# EAGLE design mp3412-boost-driver-15mm-mk-1.0 (EAGLE 7.5.0)
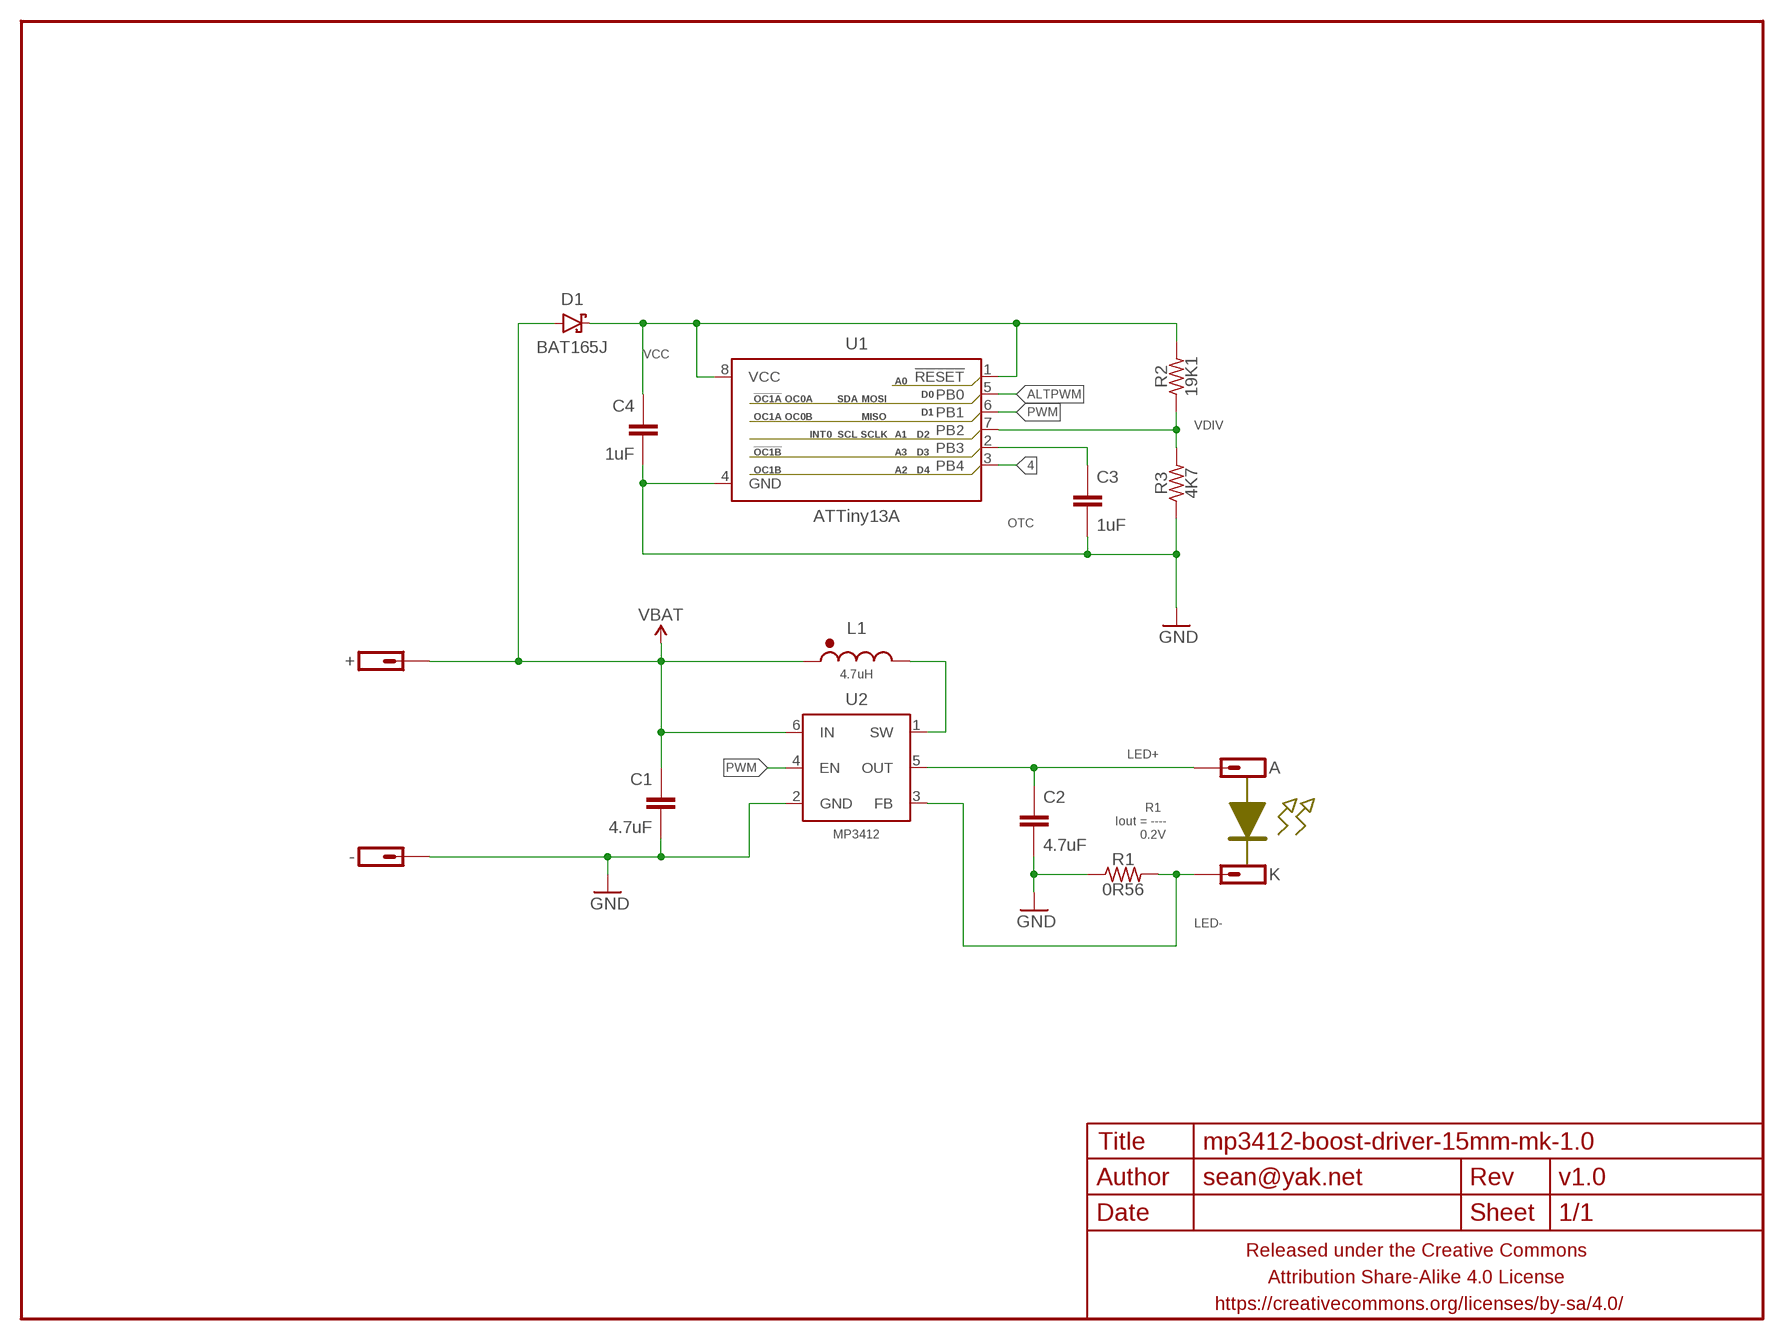
[diagram p0: schematic, sheet 1]

## Parts
+  M01PTH-1MM-CIR-NS  [1X01-1MM-CIR-NS]
-  M01NOT-A-VIA-NOPE  [1X01_NOSILK_NOSTOP]
A  M01SMD-1.25MM-DIA  [1X01-SMD-1.25MM-DIA-NS]
C1  4.7uF  CAPACITOR-CERAMICC0603-TIGHTER  [C0603-TIGHTER]
C2  4.7uF  CAPACITOR-CERAMICC0603-TIGHTER  [C0603-TIGHTER]
C3  1uF  CAPACITOR-CERAMICC0402  [C0402]
C4  1uF  CAPACITOR-CERAMICC0402  [C0402]
D1  BAT165J  DIODE-SCHOTTKYSOD323  [SOD323-SCHOTTKY]
FRAME1  FRAME-LETTERNO_PACKAGE  [DUMMY]
K  M01SMD-1.25MM-DIA  [1X01-SMD-1.25MM-DIA-NS]
L1  4.7uH  INDUCTORLPS4012-ROUND-PADS  [LPS4012-ROUND]
R1  0R56  RESISTORR0603-TIGHTER  [R0603-TIGHTER]
R2  19K1  RESISTORR0402  [R0402]
R3  4K7  RESISTORR0402  [R0402]
U1  ATTiny13A  ATTINY13SOIC-NARROWPADS  [SO08-NARROWER]
U2  MP3412  [TSOT-23-6]

## Nets
4: U1.3(PB4)
ALTPWM: U1.5(PB0)
GND: -.P$1 C1.2 C2.2 C3.2 C4.2 R1.1 R3.1 U1.4(GND) U2.2(GND)
LED+: A.P$1 C2.1 U2.5(OUT)
LED-: K.P$1 R1.2 U2.3(FB)
N$1: C3.1 U1.2(PB3)
PWM: U1.6(PB1) U2.4(EN)
SW: L1.P$2 U2.1(SW)
VBAT: +.1 C1.1 D1.A L1.P$1 U2.6(IN)
VCC: C4.1 D1.C R2.2 U1.1(!RESET) U1.8(VCC)
VDIV: R2.1 R3.2 U1.7(PB2)

## Notes on the sheet
- OTC
- R1
  Iout = ----
         0.2V

## Library data of the parts
+ - A K = a_parts:M01: Header 1 Standard 1-pin 0.1" header. Use with straight break away headers (SKU : PRT-00116), right angle break away headers (PRT-00553), swiss pins (PRT-00743), machine pins (PRT-00117), and female headers (PRT-00115).
C1-C4 = a_parts:CAPACITOR-CERAMIC: CAPACITOR, European symbol
D1 = a_parts:DIODE-SCHOTTKY: Schottky diodes in SFE's production catalog BAT20J 1A 23V 0.62Vf RB751 120mA 40V 0.37Vf PMEG4005EJ 0.5A 40V 0.42Vf MBRA140 1A 40V 0.5Vf B340A 3A 40V SMA
FRAME1 = a_parts:FRAME-LETTER: Schematic Frame Standard 8.5x11 US Letter frame; DESIGNER: sean@yak.net; VERSION: v1.0
L1 = a_parts:INDUCTOR: Inductors Basic Inductor/Choke - 0603 and 1206. Footprints are not proven and vary greatly between part numbers. SRN6045- 33uH, 20% 1.4A SDR0403-560KL - 56uH, 10%, 500mA RMS/740mA peak
R1-R3 = a_parts:RESISTOR: RESISTOR, American symbol
U1 = a_parts:ATTINY13: Atmel 8-pin 1kB flash uC
U2 = a_parts:MP3412

## Board
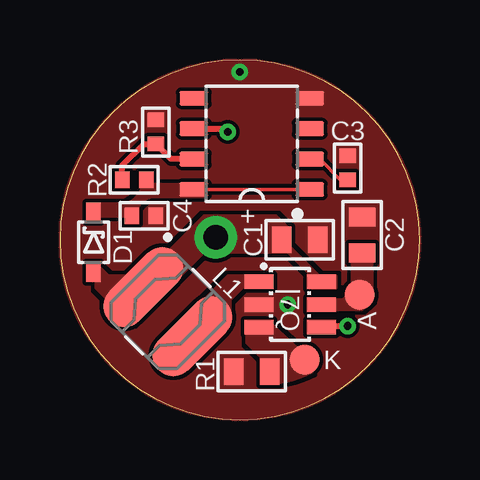
[diagram p1: board, top side]
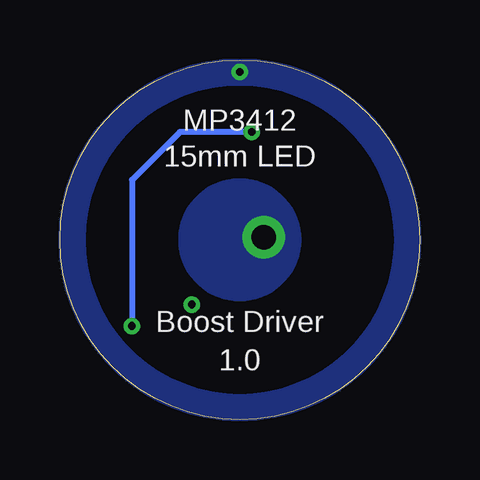
[diagram p2: board, bottom side, seen from below]

Size 15 x 15 mm. Coordinates in mm from the lower left corner, seen from the top.
Outline: 0,7.5 arc180 15,7.5 arc180 0,7.5
Copper layers (1*16): Top 0.0356mm / dielectric 1.5011mm / Bottom 0.0356mm
Design rules "LaenPCBOrder2 *": minimum track width 6mil, minimum drill 13mil, track to track 6mil, track to pad 6mil, pad to pad 6mil, via to via 6mil, smd to smd 6mil, copper to edge 0mil, drill to drill 6mil, minimum pad ring 7mil, minimum via ring 7mil, stop-mask expansion 3mil, vias tented up to drill 20mil, thermal gap 10mil

### Footprints (pad centres in the part's own frame; a part is rotated, then mirrored left to right if it is on the bottom)
1X01-1MM-CIR-NS = drill 1.016 pad 1.778: 1 0,0
1X01_NOSILK_NOSTOP = drill 0.33: P$1 0,0
1X01-SMD-1.25MM-DIA-NS = smd 1.25 x 1.25: P$1 0,0
C0603-TIGHTER = smd 0.8 x 1.1: 1 -0.75,0; 2 0.75,0
C0402 = smd 0.6 x 0.7: 1 -0.5,0; 2 0.5,0
SOD323-SCHOTTKY = smd 0.8 x 0.6: A -1.25,0; C 1.25,0
LPS4012-ROUND = smd 1.75 x 4: P$1 -1.45,0; P$2 1.45,0
R0603-TIGHTER = smd 0.8 x 1.1: 1 -0.75,0; 2 0.75,0
R0402 = smd 0.6 x 0.7: 1 -0.5,0; 2 0.5,0
SO08-NARROWER = smd 0.6 x 1.2: 1 -1.905,-2.416; 2 -0.635,-2.416; 3 0.635,-2.416; 4 1.905,-2.416; 5 1.905,2.416; 6 0.635,2.416; 7 -0.635,2.416; 8 -1.905,2.416
TSOT-23-6 = smd 0.6 x 1.2: 1 -0.95,-1.3; 2 0,-1.3; 3 0.95,-1.3; 4 0.95,1.3; 5 0,1.3; 6 -0.95,1.3

### Placement (x,y rotation side)
+  6.5,7.6 0 bottom
-  7.5,14.5 90 bottom
A  12.5,5.2 270 top
C1  10,7.5 0 top
C2  12.6,7.7 90 top
C3  12,10.5 90 top
C4  3.5,8.5 0 top
D1  1.4,7.4 90 top
FRAME1  0,0 0 top
K  10.2,2.5 0 top
L1  4.5,4.5 315 top
R1  8,2 0 top
R2  3.1,10 0 top
R3  4,12 270 top
U1  8,11.5 90 top
U2  9.6,4.8 270 top

### Tracks (layer width: path | path; a pad name or v marks a point on that pad's centre or on a via)
GND  (via drill 0.33)
  other vias: 9.5,4.8
  pour Top (isolate 0.152, rank 5, no thermals): 0,7.5 arc90 7.5,0 arc90 15,7.5 arc90 7.5,15 arc90
  pour Bottom (isolate 0.152, rank 5, no thermals): 7.5,14 arc90 1,7.5 arc90 7.5,1 arc90 14,7.5 15,7.5 arc-90 7.5,0 arc-90 0,7.5 arc-90 7.5,15 arc-90 15,7.51 14,7.51 arc90
LED+
  pour Top (isolate 0.152, rank 3, no thermals): 10.5,5 10.5,4.6 12.6,4.6 13,5 13,7 12.2,7 12.2,5.4 11.8,5
LED-
  pour Top (isolate 0.152, rank 3, no thermals): 7.8,4 8.8,4 10.5,2.4 10.5,2 arc-30 8.5,1.5 8.5,2.5 7.8,3.2
N$1
  Top 0.152: C3.1 11.7,10 10.84,10.86 U1.2
PWM  (via drill 0.33)
  Top 0.25: U1.6 6.87,12.13 v7,12 | U2.4 10.95,3.9 v12,3.9
  Bottom 0.25: v7,12 10,12 12,10 v12,3.9
SW
  pour Top (isolate 0.152, rank 3, no thermals): 4,3 7,6 8.8,6 8.8,5.52 7.62,5.52 7.1,5 7.1,4.1 5,2
VBAT
  pour Bottom (isolate 0.152, no thermals): 7.5,5 arc-90 5,7.5 arc-90 7.5,10 arc-90 10,7.5 arc-90
  pour Top (isolate 0.152, rank 3, no thermals): 1.5,6.5 1.5,5.5 3,4 6,7 9.5,7 10.5,6 10.5,5.5 11.5,5.5 11.5,6 10.8,6 9.6,7.2 9.6,7.9 9,8.5 6,8.5 4.5,7 4,7 3,6 2,6
VCC
  Top 0.152: U1.1 U1.8
  pour Top (isolate 0.152, rank 3, no thermals): 1.5,9 2.8,9 arc45 3.4,9.6 3.4,9.8 6,9.8 6,9.3 3.8,9.3 arc45 3.2,8.8 3.2,8.5 1.5,8.5
VDIV
  Top 0.25: U1.7 4.63,10.86 R3.2 3.5,11.5 2.6,10.6 R2.1

### Text on the board
tPlace: + | |7Q
bPlace: MP3412 | 15mm LED | Boost Driver